# Altium schematic sheet Sheet1.SchDoc
size A3
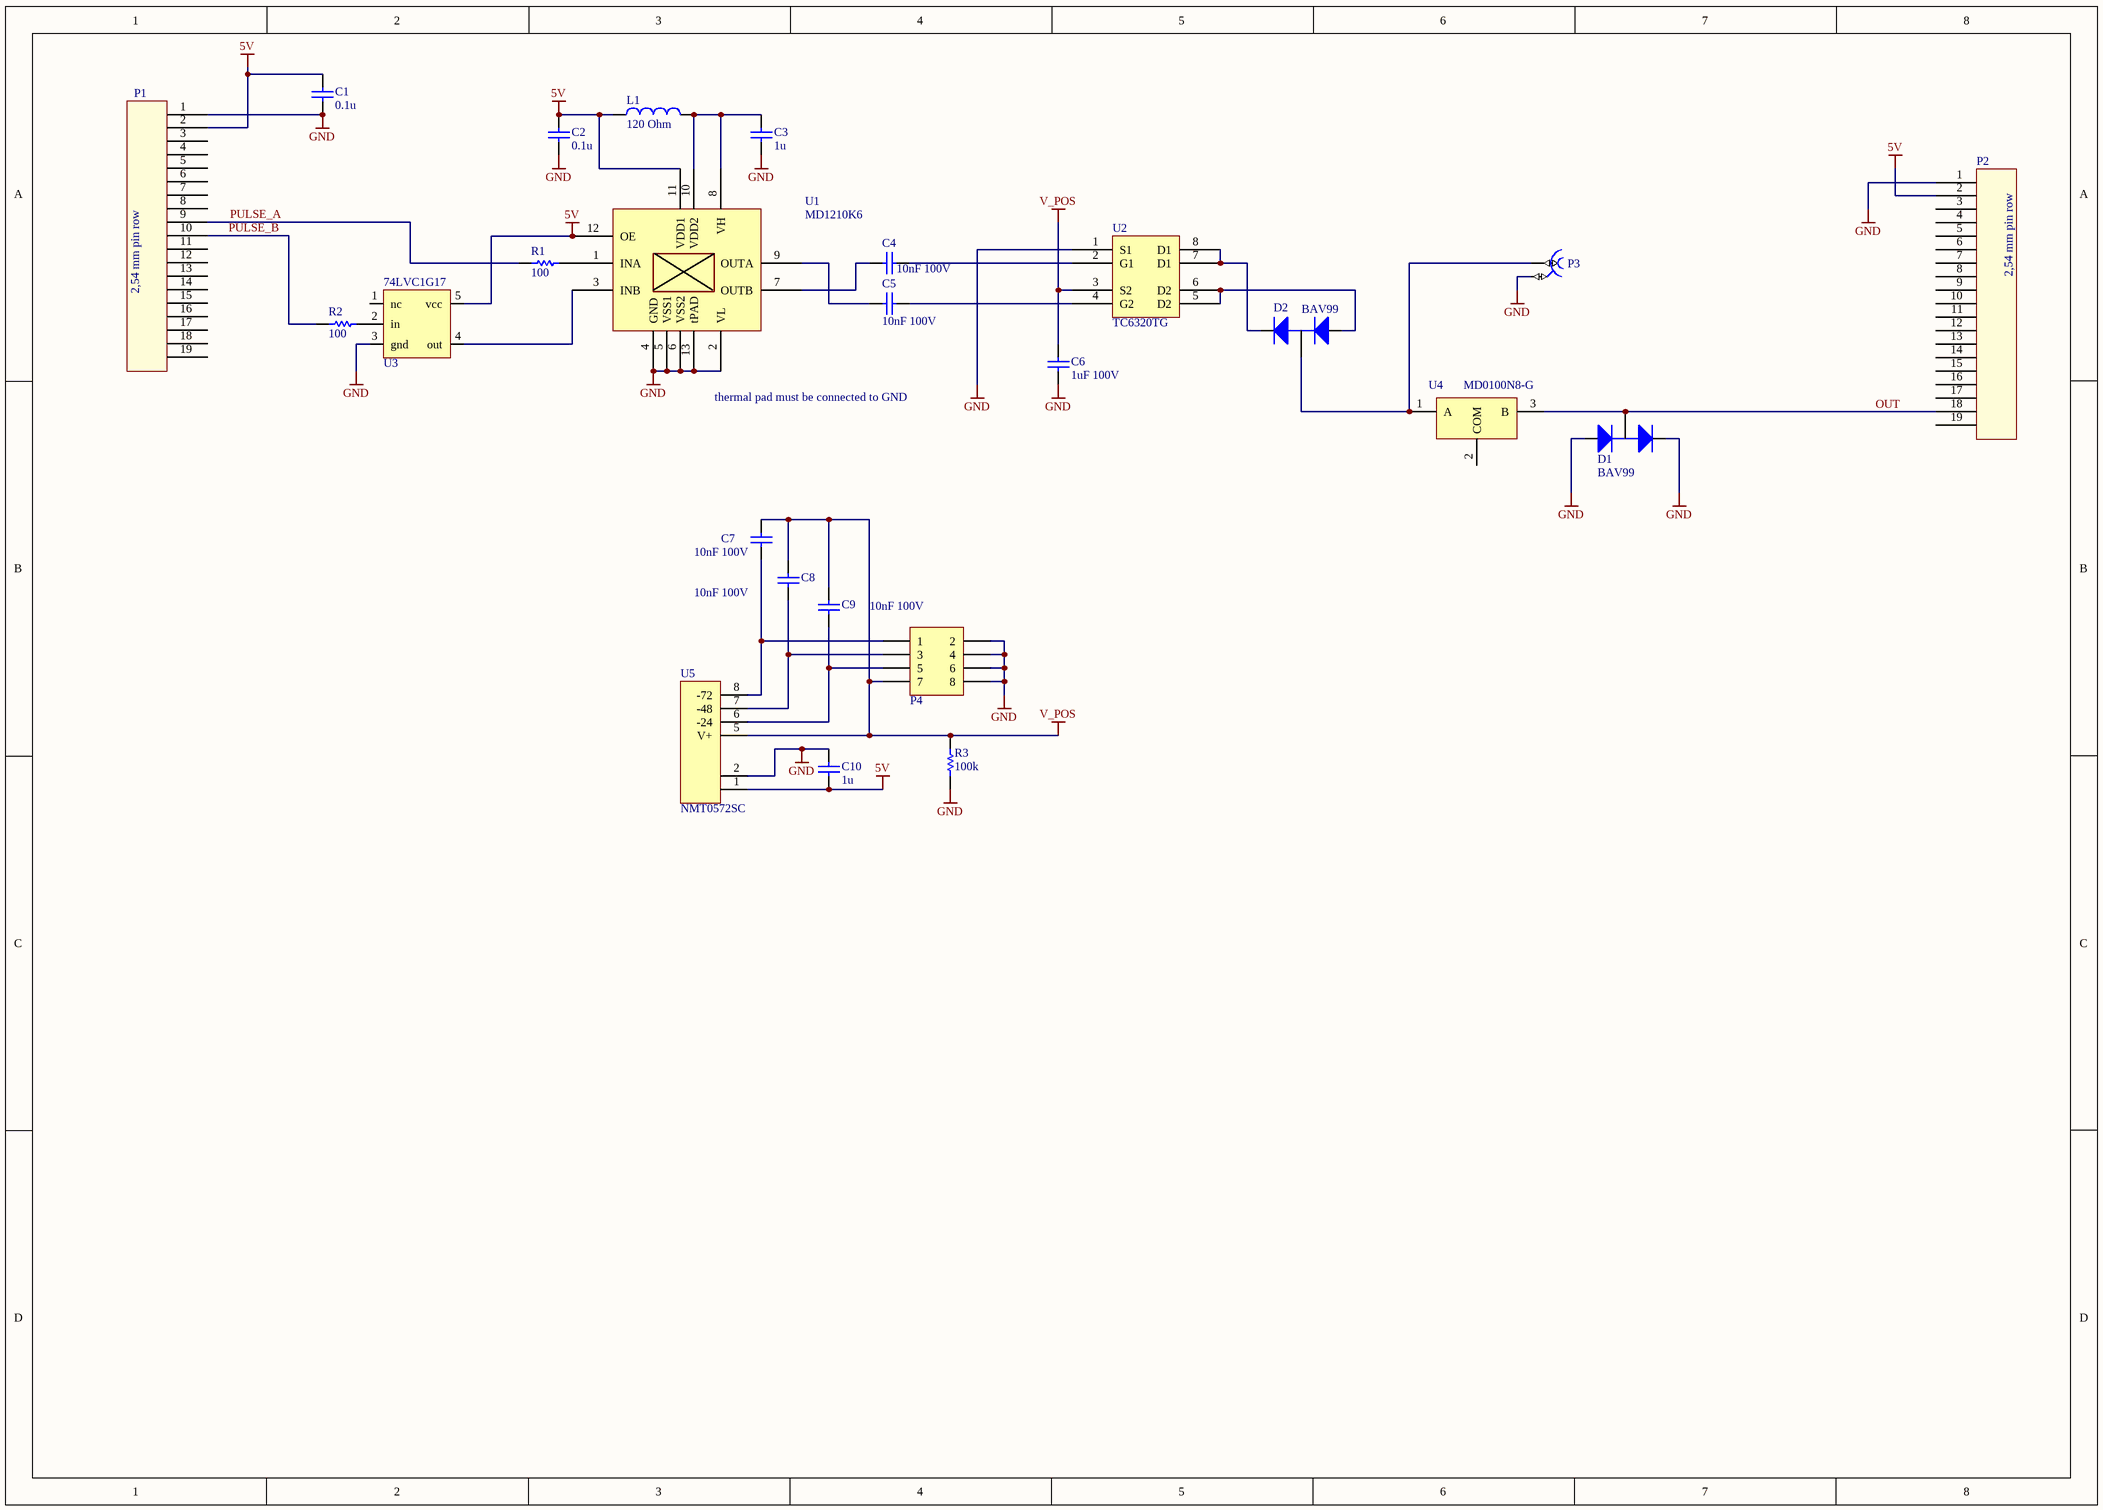
[diagram p0: Sheet1.SchDoc]

## Parts
C1  0.1u  [0603RC]
C2  0.1u  [0603RC]
C3  1u  [0805RC]
C4  10nF 100V  [0805RC]
C5  10nF 100V  [0805RC]
C6  1uF 100V  [1206RC]
C7  10nF 100V  [0805RC]
C8  10nF 100V  [0805RC]
C9  10nF 100V  [0805RC]
C10  1u  [0805RC]
D1  BAV99  [SOT-23]
D2  BAV99  [SOT-23]
L1  value 120 Ohm  [0805R]  (hidden comment: BLM21PG121SN1D)
P1  PLS_2.54mm-19  [PLS_2.54mm-19]  (value not drawn)
P2  PLS_2.54mm-19  [PLS_2.54mm-19]  (value not drawn)
P3  SMA  [AMPHENOL_132357-11]  (value not drawn)
P4  PLD-8  [PLD-8]  (value not drawn)
R1  100  [0603R]
R2  100  [0603R]
R3  100k  [0805R]
U1  MD1210K6  [QFN-12 4x4mm]
U2  TC6320TG  [SOIC127P600-8N]
U3  74LVC1G17  [SOT-23_5]
U4  MD0100N8-G  [SOT89]
U5  NMT0572SC  [NMT0572SC]

## Nets
5V: C1.2 C2.2 C10.1 L1.1 P1.2 P2.2 U1.11(VDD1) U1.12(OE) U3.5(vcc) U5.1
GND: C1.1 C2.1 C3.1 C6.1 C10.2 D1.1(A) D1.2(K) P1.1 P2.1 P3.2 P4.2 P4.4 P4.6 P4.8 R3.1 U1.2(VL) U1.4(GND) U1.5(VSS1) U1.6(VSS2) U1.13(tPAD) U2.1(S1) U3.3(gnd) U5.2
V_POS: C6.2 C7.1 C8.1 C9.1 P4.7 R3.2 U2.3(S2) U5.5(V+)
PULSE_A: P1.9 R1.1
PULSE_B: P1.10 R2.1
NetC3_2: C3.2 L1.2 U1.8(VH) U1.10(VDD2)
NetC4_1: C4.1 U2.2(G1)
NetC4_2: C4.2 U1.7(OUTB)
NetC5_1: C5.1 U2.4(G2)
NetC5_2: C5.2 U1.9(OUTA)
NetC7_2: C7.2 P4.1 U5.8(-72)
NetC8_2: C8.2 P4.3 U5.7(-48)
NetC9_2: C9.2 P4.5 U5.6(-24)
NetD1_3: D1.3(C) P2.18 U4.3(B)
NetD2_1: D2.1(A) U2.5(D2) U2.6(D2)
NetD2_2: D2.2(K) U2.7(D1) U2.8(D1)
NetD2_3: D2.3(C) P3.1 U4.1(A)
NetR1_2: R1.2 U1.1(INA)
NetR2_2: R2.2 U3.2(in)
NetU1_3: U1.3(INB) U3.4(out)

Not connected (* = marked no-connect by the designer): P1 3 4 5 6 7 8 11 12 13 14 15 16 17 18 19; P2 3 4 5 6 7 8 9 10 11 12 13 14 15 16 17 19; U3 1(nc); U4 2(COM); U5 3 4

## Notes on the sheet
- thermal pad must be connected to GND
- Labels drawn without touching a wire or pin: OUT
- (in symbol PLS_2.54mm-19) 2,54 mm pin row

## Library data of the parts
C1-C10 = Cap: Capacitor; Published: 8-Jun-2000; LatestRevisionDate: 17-Jul-2002; LatestRevisionNote: Re-released for DXP Platform.; PackageReference: RAD-0.3; Publisher: Altium Limited
  C1 C2: Value: 0.1u
  C3 C10: Value: 1u
  C4 C5 C7-C9: Value: 10nF 100V
  C6: Value: 1uF 100V
D1 D2 = BAV199: Medium-speed Switching Double Diode with Low Leakage Current; Published: 17-Sep-2003; LatestRevisionDate: 12-Dec-2006; LatestRevisionNote: IPC-7351 Footprint Added.; DatasheetVersion: 12-Oct-2001; PackageVersion: May-1999; PackageReference: SOT23; Publisher: Altium Limited; PackageDescription: 3-Pin SOT-23 Package 0.95 mm Pitch, 2.3 mm Lead Span; ComponentLink1Description: Manufacturer Link; ComponentLink1URL: http://www.semiconductors.philips.com/; ComponentLink2Description: Datasheet; ComponentLink2URL: http://www.semiconductors.philips.com/acrobat/datasheets/BAV199_4.pdf
L1 = Inductor: Code_IEC: 1005; Published: 8-Jun-2000; LatestRevisionDate: 29-May-2009; LatestRevisionNote: IPC-7351 Footprint Added.; PackageReference: 0402-A; Publisher: Altium Limited; PackageDescription: Chip Inductor; Code_JEITA: 0402
P3 = AMPHENOL_132357-11: Part Description: SMA End Launch Jack for 1.58mm PCB, 50 Ohm, Flat Tab Contact; Part Number: AMPHENOL_132357-11; Component Kind: Standard; Component Type: Standard; Pin Count: 2; Family: SMA; Mounted: Yes; Socket: No; SMD: Yes; Status: None; Manufacturer: AMPHENOL; Manufacturer Part Number: 132357-11; ComponentHeight: 7.92mm; HelpURL: \\cern.ch\dfs\Applications\Altium\Datasheets\AMPHENOL_132357-11.pdf; Author: CERN DEM JLC; CreateDate: 5/14/2012; LatestRevisionDate: 5/14/2012; Table: AMPHENOL
P4 = Header 4X2: Header, 4-Pin, Dual row; LatestRevisionDate: 17-Jul-2002; LatestRevisionNote: Re-released for DXP Platform.; Publisher: Altium Limited
R1-R3 = Res1: Resistor; Published: 8-Jun-2000; LatestRevisionDate: 17-Jul-2002; LatestRevisionNote: Re-released for DXP Platform.; PackageReference: AXIAL-0.3; Publisher: Altium Limited
  R1 R2: Value: 100
  R3: Value: 100k
U1 = MD1210
U2 = TC6320: N- and P-Channel  Enhancement-Mode MOSFET Pair
U3 = 74LVC1G17: shmitt trigger sot23-5
U4 = MD0100N8-G: 3-Ultra-Sound HV Switch 1=A 2=COM 3=B; Manufacturer: Supertex inc.; Table: Analog & Interface; Part Number: MD0100N8-G; Component Kind: Standard; Component Type: Standard; Device: MD0100N8-G; PackageDescription: SOT89-3, 3-Leads, Body 2.44x4.5mm; Part Description: Ultra-Sound HV Switch; Manufacturer Part Number: MD0100N8-G; Pin Count: 4; Case: SOT89; Mounted: Yes; Socket: No; SMD: Yes; ComponentHeight: 1.6mm; Author: S. Jafar; CreateDate: 12/20/2015; LatestRevisionDate: 1/6/2016
U5 = Header 8: Horizontal; LatestRevisionDate: 17-Jul-2002; LatestRevisionNote: Re-released for DXP Platform.; Publisher: Altium Limited